# EAGLE design rpi_pwrspl_02 (EAGLE 9.6.2)

## Sheet 1 of 2
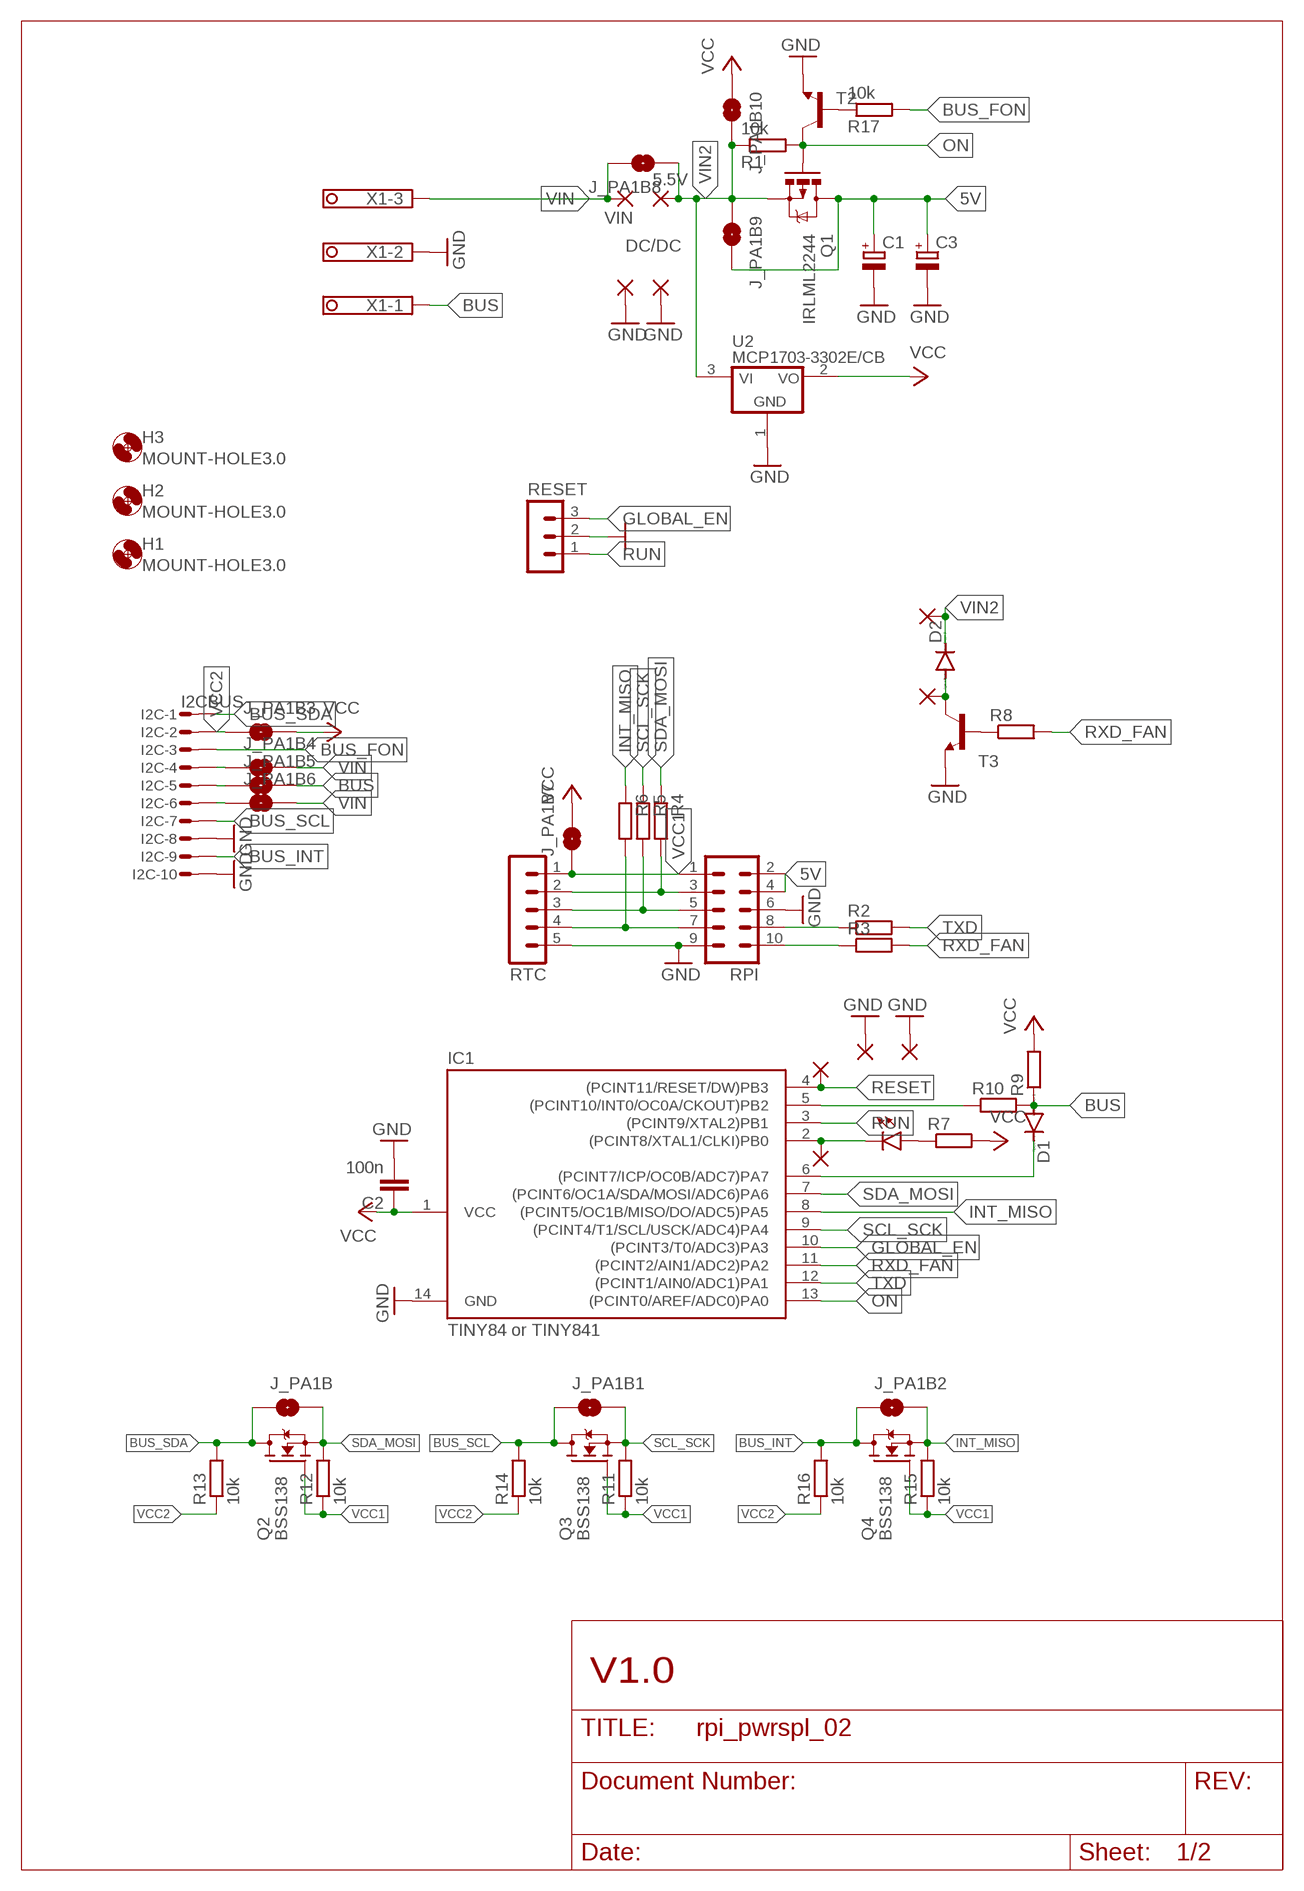
[diagram p0: schematic, sheet 1]

### Parts
5.5V  2,54/1,0  [2,54/1,0]
C1  CPOL-EUE5-5  [E5-5]
C2  100n  C-EUC0805  [C0805]
C3  CPOL-EU085CS-1AR  [085CS_1AR]
D1  DIODE-MINIMELF  [MINIMELF]
D2  DIODE-MINIMELF  [MINIMELF]
DW  1,6/0,9  [1,6/0,9]
DW1  1,6/0,9  [1,6/0,9]
DW2  1,6/0,9  [1,6/0,9]
DW3  1,6/0,9  [1,6/0,9]
DW4  1,6/0,9  [1,6/0,9]
DW5  1,6/0,9  [1,6/0,9]
H1  MOUNT-HOLE3.0  [3,0]
H2  MOUNT-HOLE3.0  [3,0]
H3  MOUNT-HOLE3.0  [3,0]
I2C  I2CBUS  MICROMATCH-10SMD  [MICROMATCH-10SMD]
IC1  TINY84 or TINY841  TINY24/44/84-SSU  [SOIC14]
J_PA1B  JUMPER-SMT_2_NO_NO-SILK  [SMT-JUMPER_2_NO_NO-SILK]
J_PA1B1  JUMPER-SMT_2_NO_NO-SILK  [SMT-JUMPER_2_NO_NO-SILK]
J_PA1B2  JUMPER-SMT_2_NO_NO-SILK  [SMT-JUMPER_2_NO_NO-SILK]
J_PA1B3  JUMPER-SMT_2_NO_NO-SILK  [SMT-JUMPER_2_NO_NO-SILK]
J_PA1B4  JUMPER-SMT_2_NO_NO-SILK  [SMT-JUMPER_2_NO_NO-SILK]
J_PA1B5  JUMPER-SMT_2_NO_NO-SILK  [SMT-JUMPER_2_NO_NO-SILK]
J_PA1B6  JUMPER-SMT_2_NO_NO-SILK  [SMT-JUMPER_2_NO_NO-SILK]
J_PA1B7  JUMPER-SMT_2_NO_NO-SILK  [SMT-JUMPER_2_NO_NO-SILK]
J_PA1B8  JUMPER-SMT_2_NO_NO-SILK  [SMT-JUMPER_2_NO_NO-SILK]
J_PA1B9  JUMPER-SMT_2_NO_NO-SILK  [SMT-JUMPER_2_NO_NO-SILK]
J_PA1B10  JUMPER-SMT_2_NO_NO-SILK  [SMT-JUMPER_2_NO_NO-SILK]
LED  LEDCHIPLED_0805  [CHIPLED_0805]
PAD1  2,54/1,0  [2,54/1,0]
PAD2  2,54/1,0  [2,54/1,0]
Q1  IRLML2244  MOSFET-PCHANNELIRLML2244  [SOT23-3]
Q2  BSS138  [SOT23]
Q3  BSS138  [SOT23]
Q4  BSS138  [SOT23]
R1  10k  R-EU_R0805  [R0805]
R2  R-EU_M0805  [M0805]
R3  R-EU_M0805  [M0805]
R4  R-EU_M0805  [M0805]
R5  R-EU_M0805  [M0805]
R6  R-EU_M0805  [M0805]
R7  100  R-EU_R0603  [R0603]
R8  R-EU_M0805  [M0805]
R9  R-EU_M0805  [M0805]
R10  R-EU_M0805  [M0805]
R11  10k  R-EU_R0805  [R0805]
R12  10k  R-EU_R0805  [R0805]
R13  10k  R-EU_R0805  [R0805]
R14  10k  R-EU_R0805  [R0805]
R15  10k  R-EU_R0805  [R0805]
R16  10k  R-EU_R0805  [R0805]
R17  10k  R-EU_R0805  [R0805]
RESET  MA03-1  [MA03-1]
RPI  MA05-2  [MA05-2]
RTC  MA05-1  [MA05-1]
T2  BC817-16-NPN-SOT23-BEC  [SOT23-BEC]
T3  BC817-16-NPN-SOT23-BEC  [SOT23-BEC]
U2  MCP1703-3302E/CB  [SOT23A_MICROCHIP_CB]
VIN  2,54/1,0  [2,54/1,0]
X1  1751251  [1751251]

### Nets
5V [power]: C1.+ C3.+ J_PA1B9.2 Q1.3(D) RPI.2 RPI.4
BUS: D1.A J_PA1B5.2 R9.1 R10.2 X1.1
BUS_FON: I2C.3 R17.2
BUS_INT: I2C.9 J_PA1B2.1 Q4.3(D) R16.2
BUS_SCL: I2C.7 J_PA1B1.1 Q3.3(D) R14.2
BUS_SDA: I2C.1 J_PA1B.1 Q2.3(D) R13.2
GLOBAL_EN: IC1.10((PCINT3/T0/ADC3)PA3) RESET.3
GND [gnd]: C1.- C2.2 C3.- DW2.1(P) DW3.1(P) I2C.8 I2C.10 IC1.14(GND) PAD1.1(P) PAD2.1(P) RESET.2 RPI.6 RPI.9 RTC.5 T2.E T3.E U2.1(GND) X1.2
INT_MISO: IC1.8((PCINT5/OC1B/MISO/DO/ADC5)PA5) J_PA1B2.2 Q4.2(S) R6.1 R15.2
N$1: I2C.4 J_PA1B4.1
N$2: R4.2 RPI.3 RTC.2
N$3: R2.1 RPI.8
N$4: R3.1 RPI.10
N$5: R5.2 RPI.5 RTC.3
N$6: LED.A R7.1
N$7: R6.2 RPI.7 RTC.4
N$8: D2.A DW4.1(P) T3.C
N$9: IC1.5((PCINT10/INT0/OC0A/CKOUT)PB2) R10.1
N$10: D1.C IC1.6((PCINT7/ICP/OC0B/ADC7)PA7)
N$11: DW1.1(P) IC1.2((PCINT8/XTAL1/CLKI)PB0) LED.C
N$13: R8.1 T3.B
N$15: R17.1 T2.B
N$16: I2C.6 J_PA1B6.1
N$17: I2C.5 J_PA1B5.1
ON: IC1.13((PCINT0/AREF/ADC0)PA0) Q1.1(G) R1.2 T2.C
RESET: DW.1(P) IC1.4((PCINT11/RESET/DW)PB3)
RUN: IC1.3((PCINT9/XTAL2)PB1) RESET.1
RXD_FAN: IC1.11((PCINT2/AIN1/ADC2)PA2) R3.2 R8.2
SCL_SCK: IC1.9((PCINT4/T1/SCL/USCK/ADC4)PA4) J_PA1B1.2 Q3.2(S) R5.1 R11.2
SDA_MOSI: IC1.7((PCINT6/OC1A/SDA/MOSI/ADC6)PA6) J_PA1B.2 Q2.2(S) R4.1 R12.2
TXD: IC1.12((PCINT1/AIN0/ADC1)PA1) R2.2
VCC [vcc]: C2.1 IC1.1(VCC) J_PA1B3.2 J_PA1B7.2 J_PA1B10.1 R7.2 R9.2 U2.2(VO)
VCC1 [vcc]: J_PA1B7.1 Q2.1(G) Q3.1(G) Q4.1(G) R11.1 R12.1 R15.1 RPI.1 RTC.1
VCC2: I2C.2 J_PA1B3.1 R13.1 R14.1 R16.1
VIN [power]: J_PA1B4.2 J_PA1B6.2 J_PA1B8.2 VIN.1(P) X1.3
VIN2 [power]: 5.5V.1(P) D2.C DW5.1(P) J_PA1B8.1 J_PA1B9.1 J_PA1B10.2 Q1.2(S) R1.1 U2.3(VI)

### Notes on the sheet
- DC/DC
- V1.0

## Sheet 2 of 2

## Library data of the parts
5.5V PAD1 PAD2 VIN = wirepad:2,54/1,0: THROUGH-HOLE PAD
C1 C3 = rcl:CPOL-EU: POLARIZED CAPACITOR, European symbol; SPICEPREFIX: C
C2 = rcl:C-EU: CAPACITOR, European symbol
D1 D2 = diode:DIODE-: DIODE
DW DW1-DW5 = wirepad:1,6/0,9: THROUGH-HOLE PAD
H1-H3 = holes:MOUNT-HOLE: MOUNTING HOLE with drill center marker
I2C = con-amp-micromatch:MICROMATCH-10: MicroMaTch 10 8-215464-0 / 1-215464-0 Drawing Number C-215464 DDEController.pdf
IC1 = avr-7:TINY24/44/84
J_PA1B J_PA1B1-J_PA1B10 = SparkFun-Jumpers:JUMPER-SMT_2_NO: Normally open jumper This jumper has two pads in close proximity to each other. Apply solder to close the connection. Round pads are easier to solder for beginners, but are a lot larger. SparkFun Product that uses the round pads: SparkFun EL Sequencer <https://www.sparkfun.com/products/12781>
LED = led:LED: LED OSRAM: - CHIPLED LG R971, LG N971, LY N971, LG Q971, LY Q971, LO R971, LY R971 LH N974, LH R974 LS Q976, LO Q976, LY Q976 LO Q996 - Hyper CHIPLED LW Q18S LB Q993, LB Q99A, LB R99A - SideLED LS A670, LO A670, LY A670, LG A670, LP A670 LB A673, LV A673, LT A673, LW A673 LH A674 LY A675 LS A676, LA A676, LO A676, LY A676, LW A676 LS A679, LY A679, LG A679 - Hyper Micro SIDELED® LS Y876, LA Y876, LO Y876, LY Y876 LT Y87S - SmartLED LW L88C, LW L88S LB L89C, LB L89S, LG L890 LS L89K, LO L89K, LY L89K LS L896, LA L896, LO L896, LY L896 - TOPLED LS T670, LO T670, LY T670, LG T670, LP T670 LSG T670, LSP T670, LSY T670, LOP T670, LYG T670 LG T671, LOG T671, LSG T671 LB T673, LV T673, LT T673, LW T673 LH T674 LS T676, LA T676, LO T676, LY T676, LB T676, LH T676, LSB T676, LW T676 LB T67C, LV T67C, LT T67C, LS T67K, LO T67K, LY T67K, LW E67C LS E67B, LA E67B, LO E67B, LY E67B, LB E67C, LV E67C, LT E67C LW T67C LS T679, LY T679, LG T679 LS T770, LO T770, LY T770, LG T770, LP T770 LB T773, LV T773, LT T773, LW T773 LH T774 LS E675, LA E675, LY E675, LS T675 LS T776, LA T776, LO T776, LY T776, LB T776 LHGB T686 LT T68C, LB T68C - Hyper Mini TOPLED® LB M676 - Mini TOPLED Santana® LG M470 LS M47K, LO M47K, LY M47K Source: http://www.osram.convergy.de LUXEON: - LUMILED® LXK2-PW12-R00, LXK2-PW12-S00, LXK2-PW14-U00, LXK2-PW14-V00 LXK2-PM12-R00, LXK2-PM12-S00, LXK2-PM14-U00 LXK2-PE12-Q00, LXK2-PE12-R00, LXK2-PE12-S00, LXK2-PE14-T00, LXK2-PE14-U00 LXK2-PB12-K00, LXK2-PB12-L00, LXK2-PB12-M00, LXK2-PB14-N00, LXK2-PB14-P00, LXK2-PB14-Q00 LXK2-PR12-L00, LXK2-PR12-M00, LXK2-PR14-Q00, LXK2-PR14-R00 LXK2-PD12-Q00, LXK2-PD12-R00, LXK2-PD12-S00 LXK2-PH12-R00, LXK2-PH12-S00 LXK2-PL12-P00, LXK2-PL12-Q00, LXK2-PL12-R00 Source: www.luxeon.com KINGBRIGHT: KA-3528ASYC Source: www.kingbright.com
Q1 = User-Submitted:MOSFET-PCHANNEL: Generic PMOSFET IRLML2244 - TRANS-11153 (SOT-23 -20V -4.3A) (1.Gate 2.Source 3.Drain) FQP27P06 - COM-10349 <http://www.sparkfun.com/products/10349> (TO-220 -60V -27A) (1.Gate 2.Source 3.Drain); PROD_ID: TRANS-11153
Q2-Q4 = bss138_10:BSS138: BSS138 N-Channel Logic Level Enhancement Mode Field Effect Transistor Source: http://www.fairchildsemi.com/datasheets/BS/BSS138.pdf; MF: Fairchild; MPN: BSS138; OC_FARNELL: 9845330; OC_NEWARK: 67R2009
R1-R10 R17 = rcl:R-EU_: RESISTOR, European symbol; SPICEPREFIX: R
R11-R16 = rcl:R-EU_: RESISTOR, European symbol
RESET = con-lstb:MA03-1: PIN HEADER; OC_FARNELL: unknown; OC_NEWARK: unknown
RPI = con-lstb:MA05-2: PIN HEADER; OC_FARNELL: unknown; OC_NEWARK: unknown
RTC = con-lstb:MA05-1: PIN HEADER; OC_FARNELL: unknown; OC_NEWARK: unknown
T2 T3 = transistor:*-NPN-: NPN Transistror BF959 corrected 2008.03.06
U2 = _hhn_MCP1703:MCP1703*02E/CB: MCP1703[A] Series of Voltage Regulators – SOT23A (Microchip CB) (1.2 … 5.0)V, LDO, 16 V Input, 100/150/200/250 mA, Low Quiescent Current Source: http://ww1.microchip.com/downloads/en/DeviceDoc/22049f.pdf http://ww1.microchip.com/downloads/en/DeviceDoc/25122A.pdf Packages: SOT23, Microchip package identifier "CB" (dimensions and recommended land patterns acc. to Microchip) Technologies: MCP1703[A]T-xx02E/CB T : Tape and Reel xx: Output Voltage * 1000 mV; 12|15|18|25|28|30|33|40|50 0 : Extra Feature Code (fixed) 2 : Output volt. Tol.: ±2% (standard) E : Temperature range (−40…+125)°C CB: Package: SOT23A Author: Dipl.-Ing. FH Rainer Bayer HHN Hochschule Heilbronn, rainer.bayer@hs-heilbronn.de Ingenieurbüro ing-rb, mail@ing-rb.de
X1 = con-phoenix-350:1751251: MKDS 1/ 3-3,5 Printklemme Nennstrom: 10 A Bemessungsspannung: 160 V Raster: 3,5 mm Polzahl: 3 Montageart: Löten Anschlussart: Schraubanschluss Anschlussrichtung vom Leiter zur Platine: 0° Source: http://eshop.phoenixcontact.com .. 1751251.pdf; OC_FARNELL: unknown; OC_NEWARK: unknown

## Net classes
1 gnd: width 0.508 mm, drill 0.254 mm
2 power: width 0.508 mm, drill 0.254 mm
3 vcc: width 0.254 mm

## Board
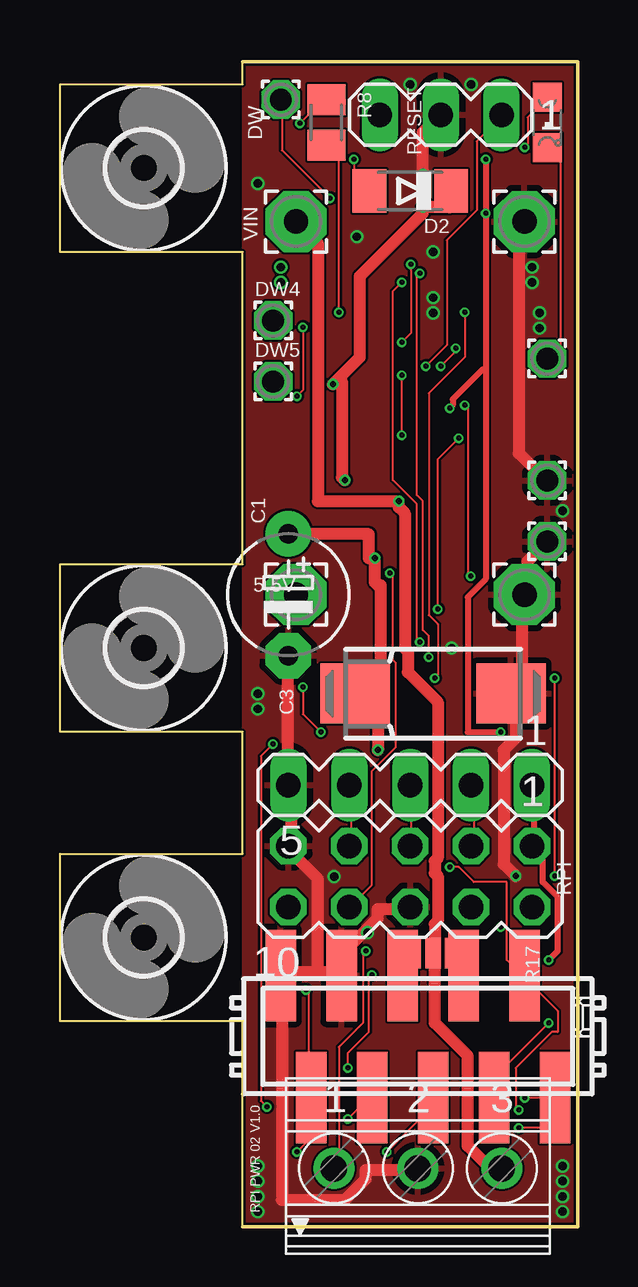
[diagram p1: board, top side]
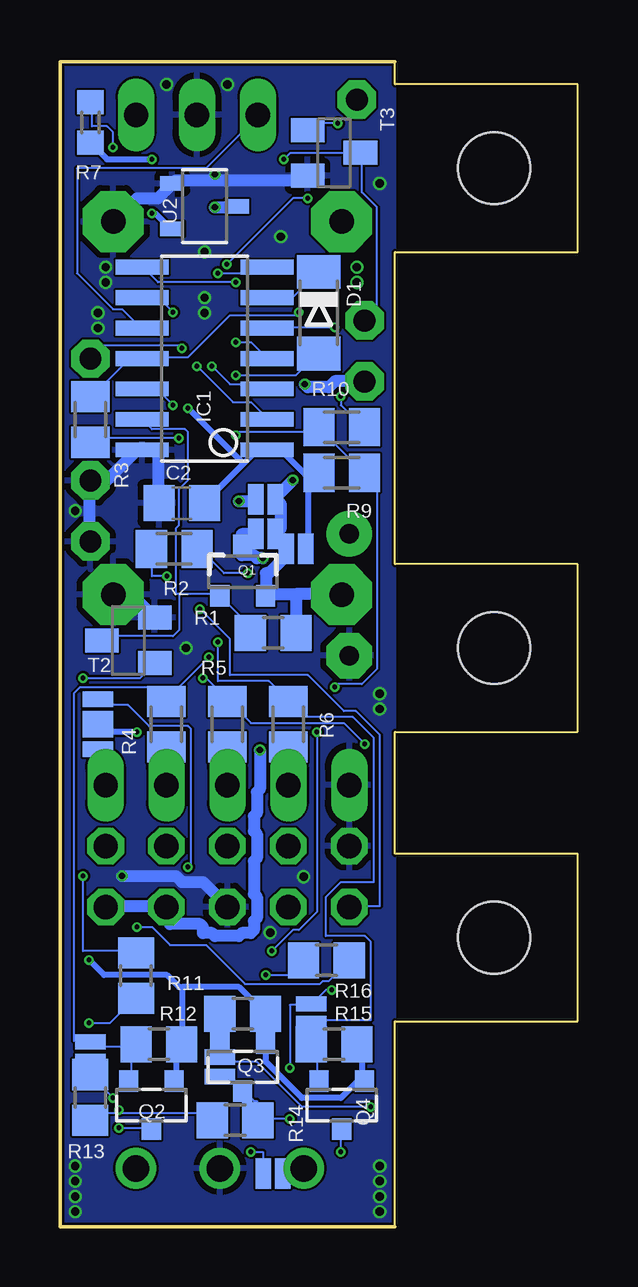
[diagram p2: board, bottom side, seen from below]

Size 21.59 x 48.58 mm. Coordinates in mm from the lower left corner, seen from the top.
Outline: 7.62,0 21.59,0 21.59,48.58 7.62,48.58 7.62,47.62 0,47.62 0,40.64 7.62,40.64 7.62,27.62 0,27.62 0,20.64 7.62,20.64 7.62,15.56 0,15.56 0,8.57 7.62,8.57 7.62,0
Copper layers (1*16): Top 0.035mm / dielectric 0.2mm / Bottom 0.035mm
Design rules "jlcpcb-2-layer": minimum track width 3.5mil, minimum drill 0.2mm, track to track 3.5mil, track to pad 5mil, pad to pad 5mil, via to via 5mil, smd to smd 0mil, copper to edge 0.1mm, drill to drill 5mil, minimum pad ring 4mil, minimum via ring 4mil, stop-mask expansion 3mil, vias tented up to drill 100mil, thermal gap 10mil

### Footprints (pad centres in the part's own frame; a part is rotated, then mirrored left to right if it is on the bottom)
2,54/1,0 = drill 1.016 pad 2.54 octagon: 1 0,0
E5-5 = drill 0.813 pad 1.905: + -2.54,0 | drill 0.813 pad 1.905 octagon: - 2.54,0
C0805 = smd 1.3 x 1.5: 1 -0.95,0; 2 0.95,0
085CS_1AR = smd 2.9 x 2.5: + 3.25,0; - -3.25,0
MINIMELF = smd 1.4 x 1.8: A 1.7,0; C -1.7,0
1,6/0,9 = drill 0.914 pad 1.6 octagon: 1 0,0
3,0 = hole 3: 0,0
MICROMATCH-10SMD = smd 1.27 x 3.81: 1 5.715,-2.54; 2 4.445,2.54; 3 3.175,-2.54; 4 1.905,2.54; 5 0.635,-2.54; 6 -0.635,2.54; 7 -1.905,-2.54; 8 -3.175,2.54; 9 -4.445,-2.54; 10 -5.715,2.54
SOIC14 = smd 0.61 x 2.21: 1 -3.81,-2.603; 2 -2.54,-2.603; 3 -1.27,-2.603; 4 0,-2.603; 5 1.27,-2.603; 6 2.54,-2.603; 7 3.81,-2.603; 8 3.81,2.603; 9 2.54,2.603; 10 1.27,2.603; 11 0,2.603; 12 -1.27,2.603; 13 -2.54,2.603; 14 -3.81,2.603
SMT-JUMPER_2_NO_NO-SILK = smd 0.635 x 1.27: 1 -0.406,0; 2 0.406,0
CHIPLED_0805 = smd 1.2 x 1.2: A 0,-1.05; C 0,1.05
SOT23-3 = smd 0.8 x 0.9: 1 -0.95,-1; 2 0.95,-1; 3 0,1.1
SOT23 = smd 0.8 x 0.9: 1 -0.95,-1; 2 0.95,-1; 3 0,1
R0805 = smd 1.3 x 1.5: 1 -0.95,0; 2 0.95,0
M0805 = smd 1.3 x 1.6: 1 -0.95,0; 2 0.95,0
R0603 = smd 1 x 1.1: 1 -0.85,0; 2 0.85,0
MA03-1 = drill 1.016 long: 1 -2.54,0; 2 0,0; 3 2.54,0
MA05-2 = drill 1.016 octagon: 1 -5.08,-1.27; 2 -5.08,1.27; 3 -2.54,-1.27; 4 -2.54,1.27; 5 0,-1.27; 6 0,1.27; 7 2.54,-1.27; 8 2.54,1.27; 9 5.08,-1.27; 10 5.08,1.27
MA05-1 = drill 1.016 long: 1 -5.08,0; 2 -2.54,0; 3 0,0; 4 2.54,0; 5 5.08,0
SOT23-BEC = smd 1 x 1.4: B -0.95,-1.1; C 0,1.1; E 0.95,-1.1
SOT23A_MICROCHIP_CB = smd 0.6 x 1: 1 -0.95,-1.35; 2 0.95,-1.35; 3 0,1.35
1751251 = drill 1.1 pad 1.7: 1 -3.5,-0.1; 2 0,-0.1; 3 3.5,-0.1

### Placement (x,y rotation side)
5.5V  9.84,26.35 0 top
C1  9.53,26.35 270 top
C2  16.51,30.16 180 bottom
C3  15.56,22.23 180 top
D1  10.79,38.1 270 bottom
D2  14.61,43.18 180 top
DW  9.21,46.99 0 top
DW1  20.32,36.2 0 top
DW2  20.32,28.57 0 top
DW3  20.32,31.11 0 top
DW4  8.89,37.78 0 top
DW5  8.89,35.24 0 top
H1  3.49,24.13 0 top
H2  3.49,44.13 0 top
H3  3.49,12.06 0 top
I2C  14.92,7.94 0 top
IC1  15.56,36.2 90 bottom
J_PA1B  20.32,7.3 90 bottom
J_PA1B1  14.92,6.67 90 bottom
J_PA1B2  11.11,8.89 270 bottom
J_PA1B3  20,21.59 270 bottom
J_PA1B4  15.96,11.42 180 top
J_PA1B5  12.7,2.22 0 bottom
J_PA1B6  15.15,11.4 0 top
J_PA1B7  20,20.32 90 bottom
J_PA1B8  13.02,30.33 180 bottom
J_PA1B9  13.02,28.89 180 bottom
J_PA1B10  11.75,28.26 180 bottom
LED  20.32,46.04 180 top
PAD1  19.37,26.35 0 top
PAD2  19.37,41.91 0 top
Q1  13.97,27.3 0 bottom
Q2  17.78,5.08 180 bottom
Q3  13.97,6.67 180 bottom
Q4  9.84,5.08 180 bottom
R1  12.7,24.77 180 bottom
R2  16.83,28.26 180 bottom
R3  20.32,33.66 90 bottom
R4  17.14,20.95 270 bottom
R5  14.61,20.95 270 bottom
R6  12.07,20.95 270 bottom
R7  20.32,46.04 270 bottom
R8  11.11,46.04 270 top
R9  9.84,31.43 180 bottom
R10  9.84,33.34 180 bottom
R11  13.97,8.89 180 bottom
R12  17.46,7.62 180 bottom
R13  20.32,5.4 90 bottom
R14  14.29,4.45 0 bottom
R15  10.16,7.62 180 bottom
R16  10.48,11.11 180 bottom
R17  18.41,10.48 270 bottom
RESET  15.88,46.35 180 top
RPI  14.61,14.61 180 top
RTC  14.61,18.41 180 top
T2  18.73,24.45 90 bottom
T3  10.16,44.77 270 bottom
U2  15.56,42.55 270 bottom
VIN  9.84,41.91 0 top
X1  14.92,2.54 0 top

### Tracks (layer width: path | path; a pad name or v marks a point on that pad's centre or on a via)
5V  (via drill 0.25)
  Top 0.508: C1.+ 9.63,28.88 12.88,28.88 12.88,27.88 v13.13,27.88 13.13,26.88 13.26,26.75 13.38,26.75 13.38,22.38 13.26,22.25 12.38,22.25 C3.+ 13.26,22 v13.26,19.88
  Bottom 0.508: RPI.2 19.63,13.38 17.25,13.38 RPI.4 17,13.12 17,12.62 15.75,12.62 15.63,12.5 15.63,12.25 15.25,12.25 15.13,12.12 14.13,12.12 14.01,12.25 13.63,12.25 13.51,12.38 13.51,12.75 13.38,12.88 13.38,13.75 13.51,13.88 13.51,15.25 13.38,15.38 13.38,16.38 13.51,16.5 13.51,17.12 13.38,17.25 13.38,18.12 13.26,18.25 v13.26,19.88 | J_PA1B9.2 13.51,28.88 14.01,28.88 14.01,28.5 Q1.3 14.01,28.25 14.01,28 13.51,28 13.38,27.88 v13.13,27.88
BUS  (via drill 0.2)
  Top 0.089: v14.26,33 v14.26,35.5 | v12.76,11.5 12.63,11.38 12.63,8.5 11.63,7.5 11.63,2.62 11.51,2.5 X1.1 | v10.88,20.62 10.13,21.38 v10.13,22.5
  Bottom 0.089: J_PA1B5.2 12.26,2.25 12.13,2.38 11.51,2.38 X1.1 | 10.63,33.12 10.76,33.25 R10.2 10.63,33.12 | 10.63,33.12 9.01,31.5 R9.1 8.88,31.38 8.38,31.38 8.38,23.25 9.01,22.62 10.01,22.62 v10.13,22.5 | v14.26,35.5 11.76,35.5 10.88,36.38 D1.A | v14.26,33 14.13,33.12 10.63,33.12 | v12.76,11.5 11.88,12.38 11.63,12.38 10.88,13.12 v10.88,20.62
BUS_FON  (via drill 0.2)
  Top 0.089: v20.38,8.5 18.13,6.25 18.13,5.5 I2C.3
  Bottom 0.089: v20.38,8.5 19.5,8.5 18.5,9.5 R17.2
BUS_INT  (via drill 0.2)
  Top 0.089: v9.88,3.12 10.38,3.62 10.38,5.38 I2C.9 10.38,5.5 10.38,9.75 v10.26,9.88 | v13.01,10.5 12.88,10.38 12.88,8.12 12.01,7.25 v12.01,6.62
  Bottom 0.089: v9.88,3.12 9.88,4 Q4.3 | v10.26,9.88 10.51,9.88 11.01,9.38 J_PA1B2.1 11.13,9.25 12.01,9.25 v12.01,6.62 | v13.01,10.5 12.01,10.5 11.51,11 R16.2
BUS_SCL  (via drill 0.2)
  Top 0.089: v12.01,4.5 13.01,5.5 I2C.7
  Bottom 0.089: J_PA1B1.1 14.88,6.25 14.51,6.25 14.01,5.75 Q3.3 13.88,5.62 13.51,5.25 13.38,5.25 13.38,4.5 R14.2 13.26,4.5 v12.01,4.5
BUS_SDA  (via drill 0.2)
  Top 0.089: v19.13,4.12 20.63,4.12 20.63,5.38 | 20.63,5.38 v19.38,5.38 | 20.63,5.38 I2C.1
  Bottom 0.089: J_PA1B.1 20.38,6.88 20.38,6.38 R13.2 20.25,6.25 v19.38,5.38 | v19.13,4.12 17.88,4.12 Q2.3
GLOBAL_EN
  Bottom 0.089: IC1.10 18.25,37.5 19,38.25 19.38,38.25 20.88,39.75 20.88,44.12 15.5,44.12 13.38,46.25 RESET.3
GND  (via drill 0.25, 0.35)
  Top 0.508: C1.- 9.51,23.75 9.51,18.62 RTC.5 9.63,18.38 9.63,15.88 RPI.9 9.63,15.62 10.76,14.5 10.76,10.62 | RPI.6 14.51,13.25 13.26,13.25 13.26,12.88 11.76,11.38 11.76,10.5 I2C.8 11.51,10.62 10.76,10.62 | X1.2 14.88,2.38 12.76,2.38 12.76,2 11.88,1.12 9.26,1.12 9.26,10.38 I2C.10 9.38,10.62 10.76,10.62 | DW2.1 20.25,28.5 19.5,27.75 19.5,26.5 PAD1.1 19.25,26.25 19.25,22.62 18.88,22.25 C3.- 19,22.12 19,20.38 18.5,19.88 18.5,15.12 v19,14.62 | v15.13,43.88 15.13,45.62 15.75,46.25 RESET.2 | DW3.1 20.25,31.12 19.13,32.25 19.13,41.75 19.25,41.88 PAD2.1
  Bottom 0.508: C2.2 17.5,30.25 17.5,32.38 18.13,32.38 IC1.14 18.38,32.38 19.63,31.12 20.25,31.12 DW3.1 20.38,30.88 20.38,28.62 DW2.1 | T2.E 17.75,25.5 18.5,26.25 19.25,26.25 PAD1.1 | PAD2.1 19.25,42 18.38,42.88 17.5,42.88 17,43.38 U2.1 16.75,43.62 15.13,43.62 | 15.13,43.62 11.51,43.62 11.38,43.75 T3.E | v15.13,43.88 15.13,43.62 | v19,14.62 16.75,14.62 16.5,14.38 15.63,14.38 14.63,13.38 RPI.6
  other vias: 8.26,22.23 8.26,21.59 8.26,43.5 14.61,47.62 17.14,47.62 20.96,29.84 20.96,2.54 20.96,1.91 20.96,1.27 20.96,0.64 8.26,2.54 8.26,1.91 8.26,1.27 8.26,0.64 20,38.1 20,37.47 15.56,40.64 15.56,38.73 15.56,38.1 19.68,40.01 19.68,39.37 16.33,24.13 12.83,12.27 11.43,14.61 12.38,41.27
  pour Bottom: 7.62,0 21.59,0 21.59,48.58 7.62,48.58
  pour Top: 7.62,0 21.59,0 21.59,48.58 7.62,48.58
INT_MISO  (via drill 0.2)
  Top 0.089: v14.26,39.38 13.88,39 13.88,31.12 14.88,30.12 14.88,24.5 v15,24.38
  Bottom 0.089: Q4.2 10.88,6.12 10.88,7.5 11.01,7.5 R15.2 11.13,7.62 11.13,8.38 J_PA1B2.2 11.01,8.5 10.88,8.62 8.63,8.62 8.63,11.88 8.88,12.12 10.51,12.12 10.51,13.75 9.88,14.38 8.51,14.38 8.51,20.38 9.38,21.25 11.38,21.25 12.01,21.88 R6.1 12.13,22 12.88,22.75 15,22.75 v15,24.38 | v14.26,39.38 17.5,39.38 18.13,40 IC1.8
N$1
  Top 0.089: J_PA1B4.1 16.38,11.38 16.75,11 16.75,10.5 I2C.4
N$2
  Top 0.089: RPI.3 17.25,15.88 17.25,18.38 RTC.2
  Bottom 0.089: R4.2 17.13,18.5 RTC.2
N$3  (via drill 0.2)
  Top 0.089: v13.76,27.25 13.88,27.12 13.88,23.62 14.01,23.5 14.01,20 13.01,19 13.01,14.25 12.13,13.38 RPI.8
  Bottom 0.089: v13.76,27.25 14.75,27.25 15.75,28.25 R2.1
N$4  (via drill 0.2)
  Top 0.089: v16.63,32.88 15.75,32 v15.75,25.75
  Bottom 0.089: v16.63,32.88 20.13,32.88 20.25,32.75 R3.1 | v15.75,25.75 14.51,24.5 14.51,23 11.26,23 9.76,21.5 9.26,21.5 8.26,20.5 8.26,13.38 9.51,13.38 RPI.10
N$5
  Top 0.089: RPI.5 14.63,15.88 14.63,18.38 RTC.3
  Bottom 0.089: R5.2 14.63,20 14.63,18.5 RTC.3
N$6  (via drill 0.2)
  Top 0.089: v19.38,45 19.5,45.12 19.5,46.25 20.25,47 LED.A
  Bottom 0.089: v19.38,45 19.38,45.62 19.63,45.88 20.25,45.88 20.25,46.88 R7.1
N$7
  Top 0.089: RPI.7 12.13,15.88 12.13,18.38 RTC.4
  Bottom 0.089: R6.2 12.13,20 12.13,18.5 RTC.4
N$8  (via drill 0.2)
  Top 0.089: v12.26,44.5 12.26,43.88 12.88,43.25 D2.A
  Bottom 0.089: DW4.1 8.88,37.88 8.38,37.88 8.38,42.5 9.01,43.12 9.01,44.75 T3.C 9.13,44.75 12.01,44.75 v12.26,44.5
N$9  (via drill 0.2)
  Top 0.089: v9.88,34.62 10.13,34.88 v10.13,37.5
  Bottom 0.089: v9.88,34.62 9.88,34.25 9.01,33.38 R10.1 | v10.13,37.5 12.88,37.5 IC1.5
N$10
  Bottom 0.089: D1.C 10.88,39.75 11.88,38.75 12.88,38.75 IC1.6
N$11  (via drill 0.2)
  Top 0.089: LED.C 20.38,44.88 20.88,44.38 20.88,36.75 20.38,36.25 DW1.1 | v15.88,35.88 16.5,36.5 v16.5,36.62
  Bottom 0.089: v15.88,35.88 14.38,34.38 13.63,34.38 13.01,33.75 IC1.2 | v16.5,36.62 16.63,36.75 19.75,36.75 20.25,36.25 DW1.1
N$12  (via drill 0.35)
  other vias: 9.21,40.01
N$13  (via drill 0.2)
  Top 0.089: v10.01,46 11.01,47 R8.1
  Bottom 0.089: v10.01,46 11.01,46 11.26,45.75 T3.B
N$14  (via drill 0.35)
  other vias: 9.21,39.37
N$15  (via drill 0.2)
  Top 0.089: v20.63,14.62 v20.63,22.88
  Bottom 0.089: T2.B 18.25,22.88 v20.63,22.88 | v20.63,14.62 20.63,11.5 18.5,11.5 R17.1
N$16
  Top 0.089: J_PA1B6.1 14.63,11.38 14.38,11.12 14.38,10.5 I2C.6
N$17  (via drill 0.2)
  Top 0.089: v13.63,3.12 15.5,5 15.5,5.38 I2C.5
  Bottom 0.089: v13.63,3.12 13.13,3.12 13.13,2.25 J_PA1B5.1
ON
  Bottom 0.089: R1.2 13.63,24.88 13.63,25 14.88,26.25 Q1.1 15,26.38 16.63,26.38 | 16.63,26.38 16.63,24.88 16.88,24.62 19.63,24.62 19.75,24.5 T2.C | 16.63,26.38 16.75,26.38 16.75,29.12 16.63,29.25 16.63,30.75 16.25,31.12 16.25,33.12 16.38,33.25 17.75,33.25 18.13,33.62 IC1.13
RESET  (via drill 0.2)
  Top 0.089: v14.26,36.88 14.63,37.25 v14.63,40.12 | v11.26,42.88 9.26,44.88 9.26,46.88 DW.1
  Bottom 0.089: v14.26,36.88 13.63,36.88 13.01,36.25 IC1.4 | v14.63,40.12 11.88,42.88 v11.26,42.88
RUN  (via drill 0.2)
  Top 0.089: v15.25,35.88 16.13,36.75 16.13,41.12 17.38,42.38 17.38,45.25 18.38,46.25 RESET.1
  Bottom 0.089: v15.25,35.88 14.51,35.12 13.13,35.12 13.01,35 IC1.3
RXD_FAN  (via drill 0.2)
  Top 0.089: v11.63,38.12 11.63,44.5 11.13,45 R8.2
  Bottom 0.089: R3.2 20.25,34.62 18.75,36.12 18.25,36.12 IC1.11 18.13,36.25 16.25,36.25 14.51,38 11.76,38 v11.63,38.12
SCL_SCK  (via drill 0.2)
  Top 0.089: v15.63,22.88 15.75,23 15.75,25.12 15.38,25.5 15.38,34.75 16.88,36.25 v16.88,38.12 | v8.63,5 8.38,5.25 8.38,19.62 v8.88,20.12
  Bottom 0.089: R11.2 15,8.88 15,7.75 Q3.2 15,7.62 15,7.12 J_PA1B1.2 14.88,7 14.75,6.88 13.38,6.88 11.51,5 v8.63,5 | v15.63,22.88 15.5,22.88 14.63,22 R5.1 14.51,21.88 13.63,21 9.76,21 v8.88,20.12 | v16.88,38.12 17.38,38.62 18.13,38.62 IC1.9
SDA_MOSI  (via drill 0.2)
  Top 0.089: v15,39.75 14.88,39.62 14.88,30.5 15.13,30.25 15.13,24.88 15.38,24.62 v15.38,23.75
  Bottom 0.089: 18.63,7.5 18.63,6.12 Q2.2 | 18.63,7.5 18.5,7.5 R12.2 18.63,7.5 | 18.63,7.5 20.13,7.5 20.25,7.62 J_PA1B.2 20.38,7.75 21,7.75 21,22.25 20.75,22.5 17.75,22.5 17.25,22 R4.1 17.13,22 v15.38,23.75 | v15,39.75 13.26,39.75 13.01,40 IC1.7
TXD  (via drill 0.2)
  Top 0.089: v17.13,27.12 17,27.25 17,34.12 v16.88,34.25
  Bottom 0.089: v17.13,27.12 17.75,27.12 17.75,28.25 R2.2 | v16.88,34.25 17.5,34.88 18.13,34.88 IC1.12
VCC  (via drill 0.2)
  Top 0.254: v17.75,44.5 v17.75,42.25 17.75,35.75 | v18.38,20.62 17,20.62 17,26.25 17.75,27 17.75,35.75 | v16.25,34.12 16.38,34.25 16.38,34.5 17.63,35.75 17.75,35.75
  Bottom 0.254: J_PA1B10.1 11.26,28.38 11.26,31.38 10.88,31.38 R9.2 11.38,31.38 12.38,32.38 12.88,32.38 IC1.1 13.01,32.38 13.38,32.38 13.94,31.81 | 13.94,31.81 15.5,30.25 C2.1 | J_PA1B3.2 20,21.12 20,20.75 J_PA1B7.2 19.88,20.62 v18.38,20.62 | v17.75,42.25 17.63,42.25 17,41.62 U2.2 | v17.75,44.5 19.63,44.5 20.25,45.12 R7.2 | v16.25,34.12 13.94,31.81
VCC1  (via drill 0.2)
  Top 0.254: RTC.1 19.75,18.38 19.75,15.88 RPI.1 19.75,15.75 20.13,15.38 20.13,14.38 20.75,13.75 20.75,11.5 v20.38,11.12
  Bottom 0.254: J_PA1B7.1 19.88,19.88 19.88,18.5 19.75,18.5 RTC.1 | Q2.1 16.75,6.12 16.75,7.5 16.63,7.5 R12.1 16.5,10 | R15.1 9.13,7.5 9.01,7.5 9.01,6.12 Q4.1 9.13,6.12 9.88,5.38 11.51,5.38 13.01,6.88 13.01,7.62 Q3.1 13.01,7.75 13.01,8.88 R11.1 14.13,10 16.5,10 | v20.38,11.12 19.75,10.5 17.13,10.5 16.63,10 16.5,10
VCC2  (via drill 0.2)
  Top 0.089: v16.25,15 16.63,15 17.25,14.38 18.63,14.38 18.63,12.5 | 18.63,12.5 18.63,11.12 19.25,10.5 I2C.2 19.38,10.38 20.75,9 20.75,8.12 20.5,8.12 19,6.62 19,5 v19.13,4.88 | 18.63,12.5 v18.38,12.5
  Bottom 0.089: 19.13,4.75 20,4.75 20.25,4.5 R13.1 | 19.13,4.75 15.5,4.75 15.25,4.5 R14.1 | v16.25,15 16.13,15 16.13,20.75 16.25,20.88 17.88,20.88 18.75,21.75 19.75,21.75 19.88,21.88 J_PA1B3.1 | v18.38,12.5 17.75,12.5 17,11.75 15.5,11.75 13.88,10.12 10.76,10.12 10.63,10.25 10.38,10.25 9.63,11 R16.1 | v19.13,4.88 19.13,4.75
VIN  (via drill 0.25)
  Top 0.508: J_PA1B6.2 15.5,11.5 J_PA1B4.2 | J_PA1B6.2 15.63,11.25 15.63,8.5 17,7.12 17,3.38 17.88,2.5 18.38,2.5 X1.3 | VIN.1 9.88,41.88 10.76,41 10.76,30.25 v14.13,30.25 14.13,30 14.38,29.75 14.38,24.12 14.51,24 14.51,23.12 15.75,21.88 15.75,15.38 15.63,15.25 15.63,14.75 15.75,14.62 15.75,12.75 15.63,12.62 15.63,11.88 15.5,11.75 J_PA1B6.2
  Bottom 0.508: v14.13,30.25 13.51,30.25 J_PA1B8.2
VIN2  (via drill 0.25)
  Top 0.508: D2.C 16.25,43.12 16.25,42.5 v15.13,42.5 15.13,42.25 12.51,39.62 12.51,36.25 11.63,35.38 | v11.38,35.12 11.63,35.38 | v11.88,31.12 11.76,31.25 11.76,35.25 11.63,35.38
  Bottom 0.508: 11.76,26.38 11.76,24.88 R1.1 | 11.76,26.38 12.76,26.38 Q1.2 13.01,26.38 13.01,27.25 12.88,27.25 12.13,28 12.13,28.25 J_PA1B10.2 12.13,28.5 12.51,28.88 J_PA1B9.1 12.51,29.12 12.38,29.12 12.38,30.12 12.51,30.25 J_PA1B8.1 12.51,30.5 v11.88,31.12 | 11.76,26.38 9.88,26.38 5.5V.1 | v15.13,42.5 14.26,42.5 U2.3 | v11.38,35.12 11.26,35 10.38,35 10.13,35.25 9.01,35.25 DW5.1

### Text on the board
tPlace: RPI PWR 02 V1.0